# EAGLE design LiFiShieldV2 (EAGLE 9.2.2)
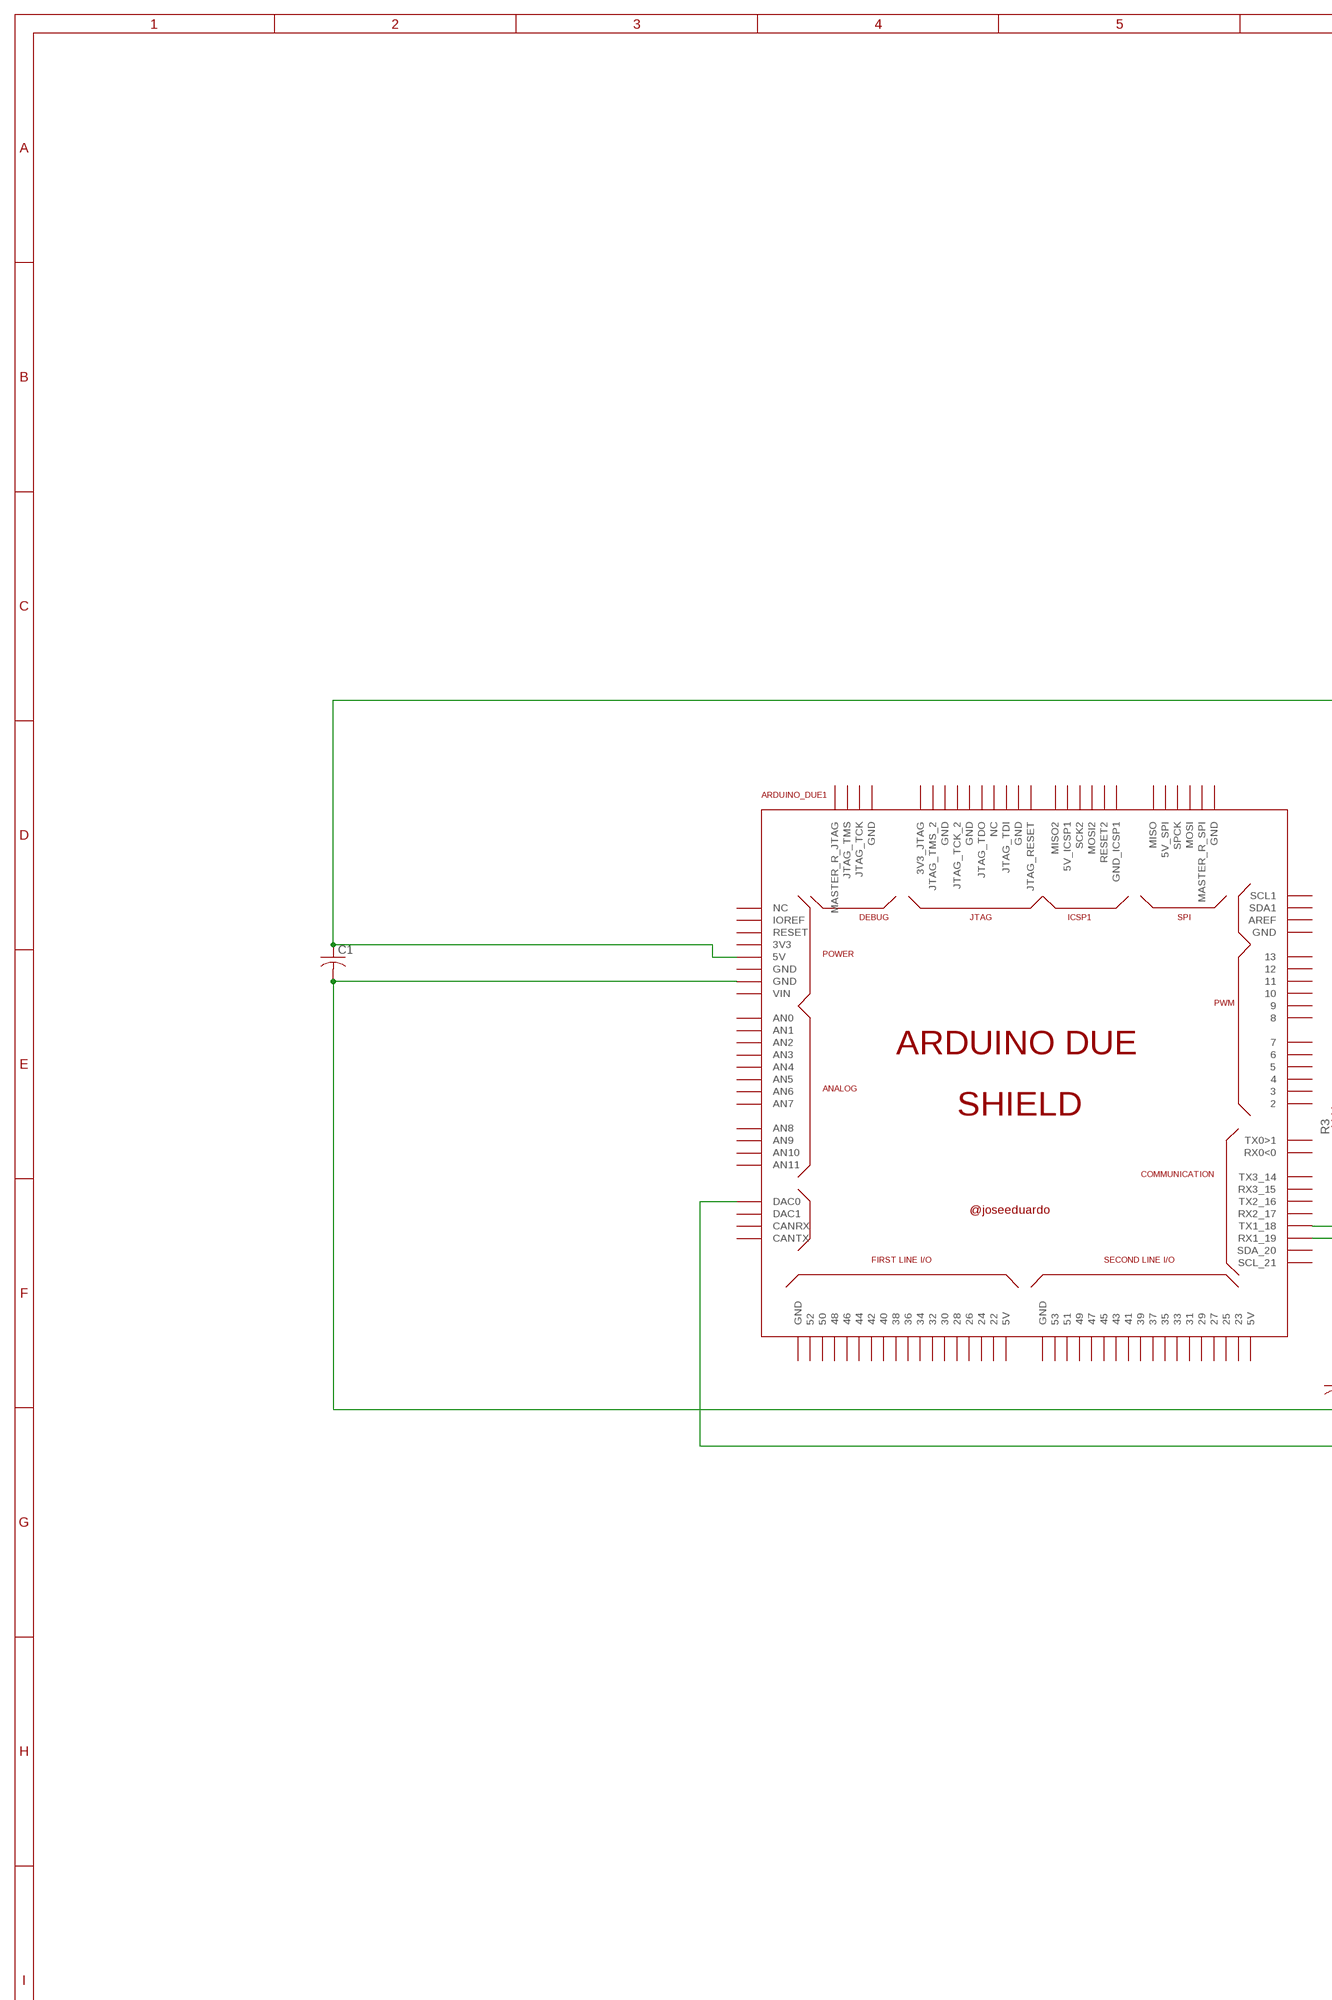
[diagram p0: schematic, sheet 1, part 1 of 2]
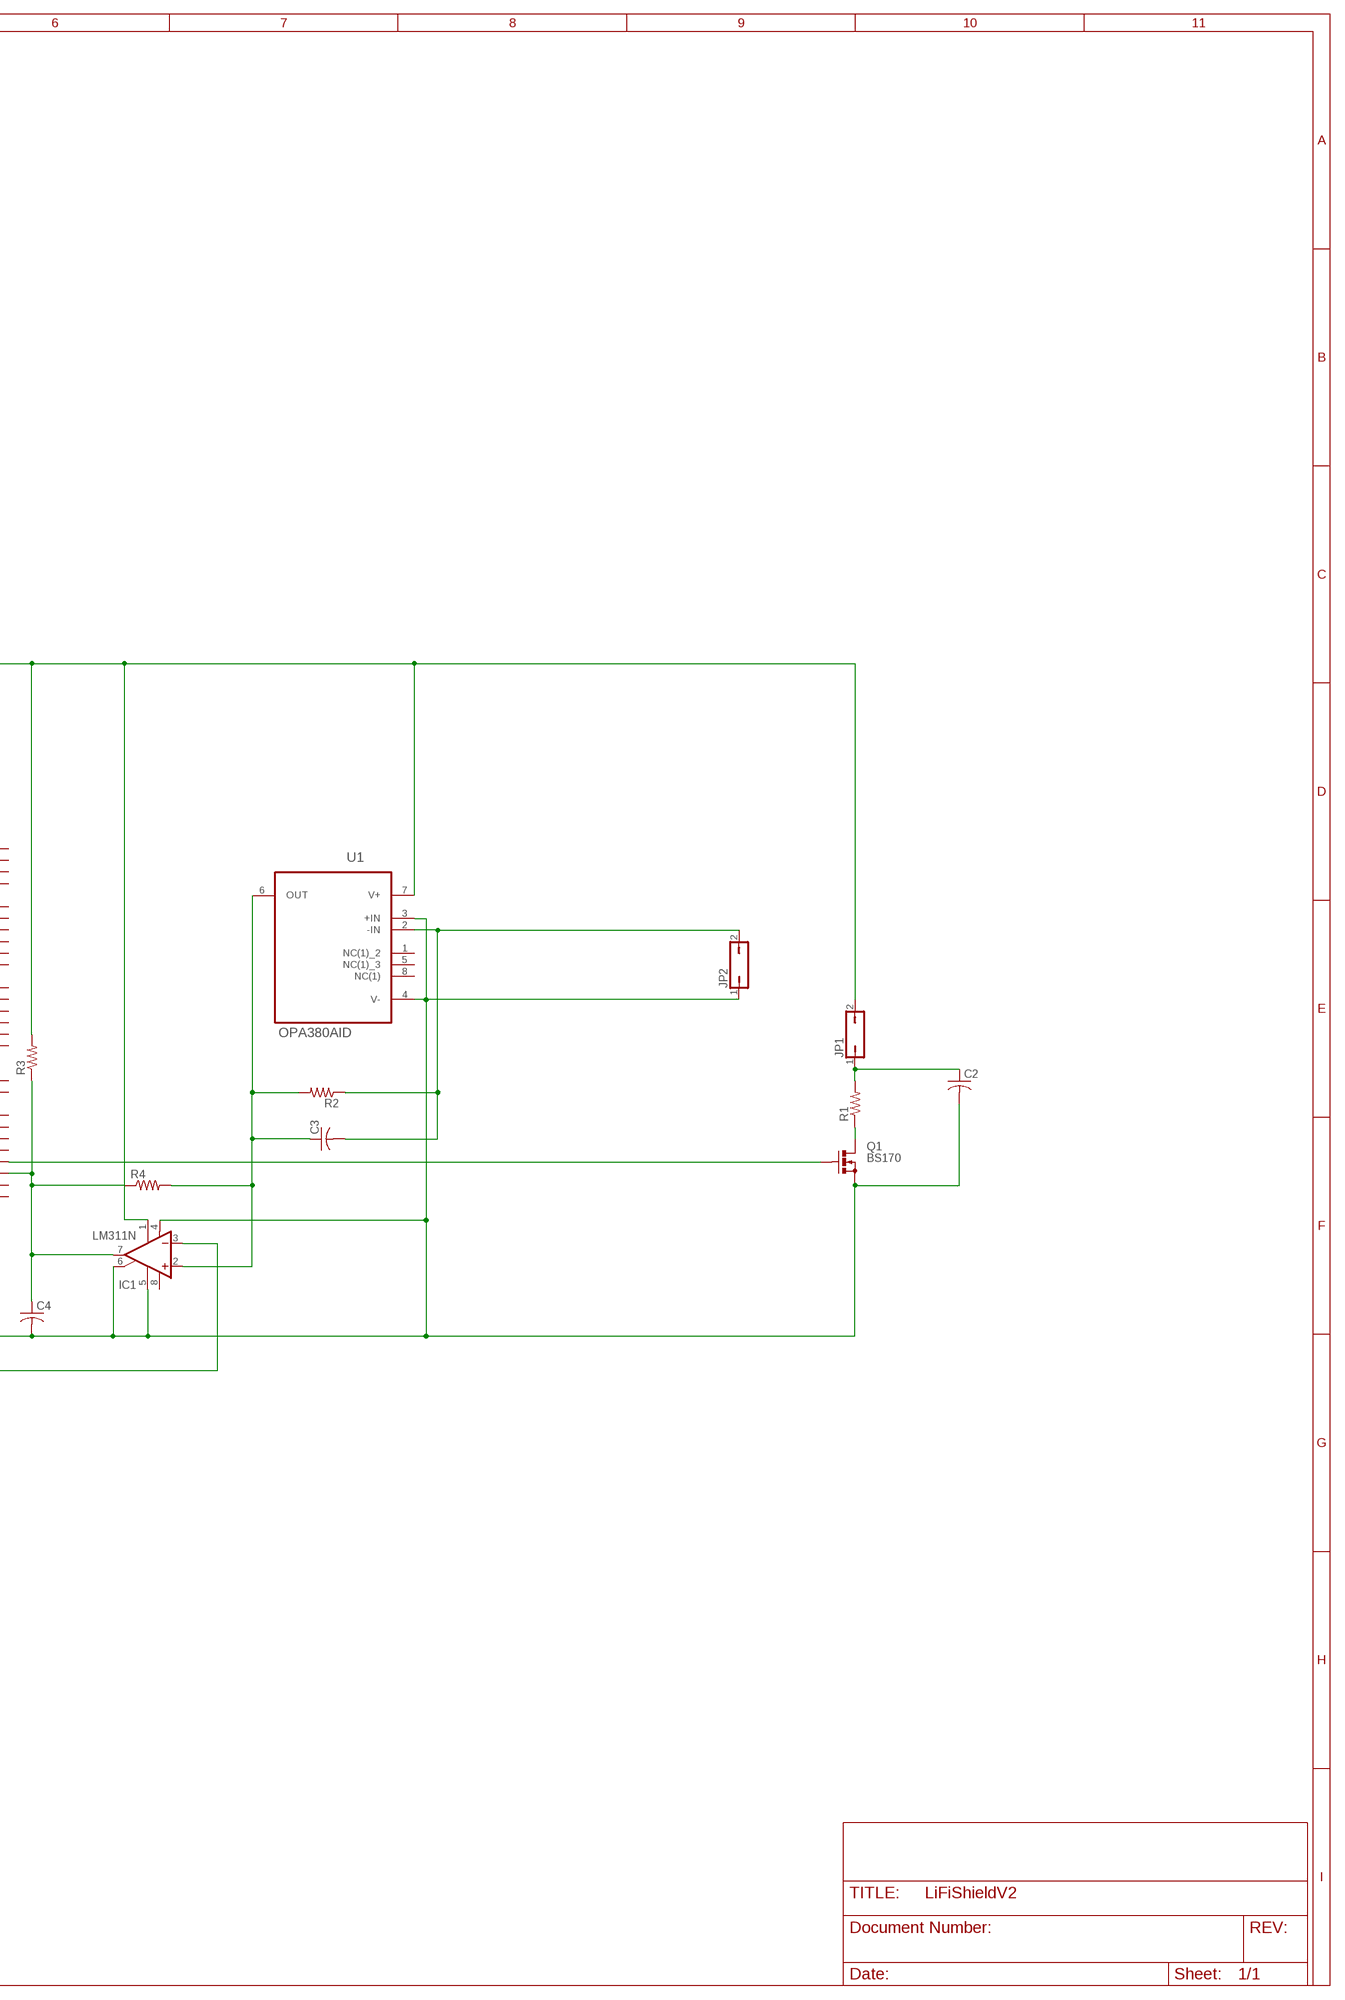
[diagram p1: schematic, sheet 1, part 2 of 2]

## Parts
ARDUINO_DUE1  ARDUINO_DUE_SHIELD  [ARDUINO_DUE_SHIELD]
C1  C-US050-055X075  [C050-055X075]
C2  C-US050-055X075  [C050-055X075]
C3  C-US050-055X075  [C050-055X075]
C4  C-US050-055X075  [C050-055X075]
IC1  LM311N  [DIL08]
JP1  JP1Q  [JP1]
JP2  JP1Q  [JP1]
Q1  BS170  [SOT54E]
R1  R-US_0204/7  [0204/7]
R2  R-US_0204/7  [0204/7]
R3  R-US_0204/7  [0204/7]
R4  R-US_0204/7  [0204/7]
U1  OPA380AID  [SOIC127P600X175-8N]

## Nets
N$1: C2.1 JP1.1 R1.2
N$2: Q1.D R1.1
N$3: ARDUINO_DUE1.DAC0 IC1.3(-IN)
N$4: ARDUINO_DUE1.18(TX1_18) Q1.G
N$5: C3.1 IC1.2(+IN) R2.2 R4.2 U1.6(OUT)
N$6: C3.2 JP2.2 R2.1 U1.2(-IN)
N$7: ARDUINO_DUE1.19(RX1_19) C4.1 IC1.7(OUT) R3.1 R4.1
N$8: ARDUINO_DUE1.GND_1(GND) C1.2 C2.2 C4.2 IC1.4(V-) IC1.5(ON) IC1.6(ON/STR) JP2.1 Q1.S U1.3(+IN) U1.4(V-)
N$9: ARDUINO_DUE1.5V0(5V) C1.1 IC1.1(GND) JP1.2 R3.2 U1.7(V+)
Unconnected: ARDUINO_DUE1.0(RX0<0) ARDUINO_DUE1.1(TX0>1) ARDUINO_DUE1.2 ARDUINO_DUE1.3 ARDUINO_DUE1.3V3 ARDUINO_DUE1.3V3_JTAG ARDUINO_DUE1.4 ARDUINO_DUE1.5 ARDUINO_DUE1.5V0_1(5V) ARDUINO_DUE1.5V0_2(5V) ARDUINO_DUE1.5V_2(5V_SPI) ARDUINO_DUE1.5V_ICSP1 ARDUINO_DUE1.6 ARDUINO_DUE1.7 ARDUINO_DUE1.8 ARDUINO_DUE1.9 ARDUINO_DUE1.10 ARDUINO_DUE1.11 ARDUINO_DUE1.12 ARDUINO_DUE1.13 ARDUINO_DUE1.14(TX3_14) ARDUINO_DUE1.15(RX3_15) ARDUINO_DUE1.16(TX2_16) ARDUINO_DUE1.17(RX2_17) ARDUINO_DUE1.20(SDA_20) ARDUINO_DUE1.21(SCL_21) ARDUINO_DUE1.22 ARDUINO_DUE1.23 ARDUINO_DUE1.24 ARDUINO_DUE1.25 ARDUINO_DUE1.26 ARDUINO_DUE1.27 ARDUINO_DUE1.28 ARDUINO_DUE1.29 ARDUINO_DUE1.30 ARDUINO_DUE1.31 ARDUINO_DUE1.32 ARDUINO_DUE1.33 ARDUINO_DUE1.34 ARDUINO_DUE1.35 ARDUINO_DUE1.36 ARDUINO_DUE1.37 ARDUINO_DUE1.38 ARDUINO_DUE1.39 ARDUINO_DUE1.40 ARDUINO_DUE1.41 ARDUINO_DUE1.42 ARDUINO_DUE1.43 ARDUINO_DUE1.44 ARDUINO_DUE1.45 ARDUINO_DUE1.46 ARDUINO_DUE1.47 ARDUINO_DUE1.48 ARDUINO_DUE1.49 ARDUINO_DUE1.50 ARDUINO_DUE1.51 ARDUINO_DUE1.52 ARDUINO_DUE1.53 ARDUINO_DUE1.A0(AN0) ARDUINO_DUE1.A1(AN1) ARDUINO_DUE1.A2(AN2) ARDUINO_DUE1.A3(AN3) ARDUINO_DUE1.A4(AN4) ARDUINO_DUE1.A5(AN5) ARDUINO_DUE1.A6(AN6) ARDUINO_DUE1.A7(AN7) ARDUINO_DUE1.A8(AN8) ARDUINO_DUE1.A9(AN9) ARDUINO_DUE1.A10(AN10) ARDUINO_DUE1.A11(AN11) ARDUINO_DUE1.AREF ARDUINO_DUE1.CANRX ARDUINO_DUE1.CANTX ARDUINO_DUE1.DAC1 ARDUINO_DUE1.GND ARDUINO_DUE1.GND_2(GND) ARDUINO_DUE1.GND_3(GND) ARDUINO_DUE1.GND_4(GND) ARDUINO_DUE1.GND_5(GND) ARDUINO_DUE1.GND_7(GND) ARDUINO_DUE1.GND_8(GND) ARDUINO_DUE1.GND_9(GND) ARDUINO_DUE1.GND_10(GND) ARDUINO_DUE1.GND_ICSP1 ARDUINO_DUE1.IOREF ARDUINO_DUE1.JTAG_RESET ARDUINO_DUE1.JTAG_TCK ARDUINO_DUE1.JTAG_TCK_2 ARDUINO_DUE1.JTAG_TDI ARDUINO_DUE1.JTAG_TDO ARDUINO_DUE1.JTAG_TMS ARDUINO_DUE1.JTAG_TMS_2 ARDUINO_DUE1.MASTER_RESET_JTAG(MASTER_R_JTAG) ARDUINO_DUE1.MASTER_RESET_SPI(MASTER_R_SPI) ARDUINO_DUE1.MISO ARDUINO_DUE1.MISO2 ARDUINO_DUE1.MOSI ARDUINO_DUE1.MOSI2 ARDUINO_DUE1.NC_2(NC) ARDUINO_DUE1.NC_5(NC) ARDUINO_DUE1.RESET ARDUINO_DUE1.RESET2 ARDUINO_DUE1.SCK2 ARDUINO_DUE1.SCL1 ARDUINO_DUE1.SDA1 ARDUINO_DUE1.SPCK ARDUINO_DUE1.VIN U1.1(NC(1)_2) U1.5(NC(1)_3) U1.8(NC(1))

## Power pins joined to a net without a drawn wire
V+: IC1.8(V+)

## Library data of the parts
ARDUINO_DUE1 = arduino_due_shield:ARDUINO_DUE_SHIELD
C1-C4 = adafruit:C-US: CAPACITOR, American symbol
IC1 = linear:LM311: COMPARATOR
JP1 JP2 = jumper:JP1Q: JUMPER
Q1 = transistor-small-signal:BS170: N-CHANNEL MOS FET
R1-R4 = adafruit:R-US_: RESISTOR, American symbol
U1 = Texas Instruments_By_element14_Batch_1:OPA380AID: Precision, High-Speed Transimpedance Amplifier; MPN: OPA380AID; OC_FARNELL: -; OC_NEWARK: 01J0608; PACKAGE: SOIC-8; SUPPLIER: Texas Instruments

## Net classes
0 default: width 0.508 mm

## Board
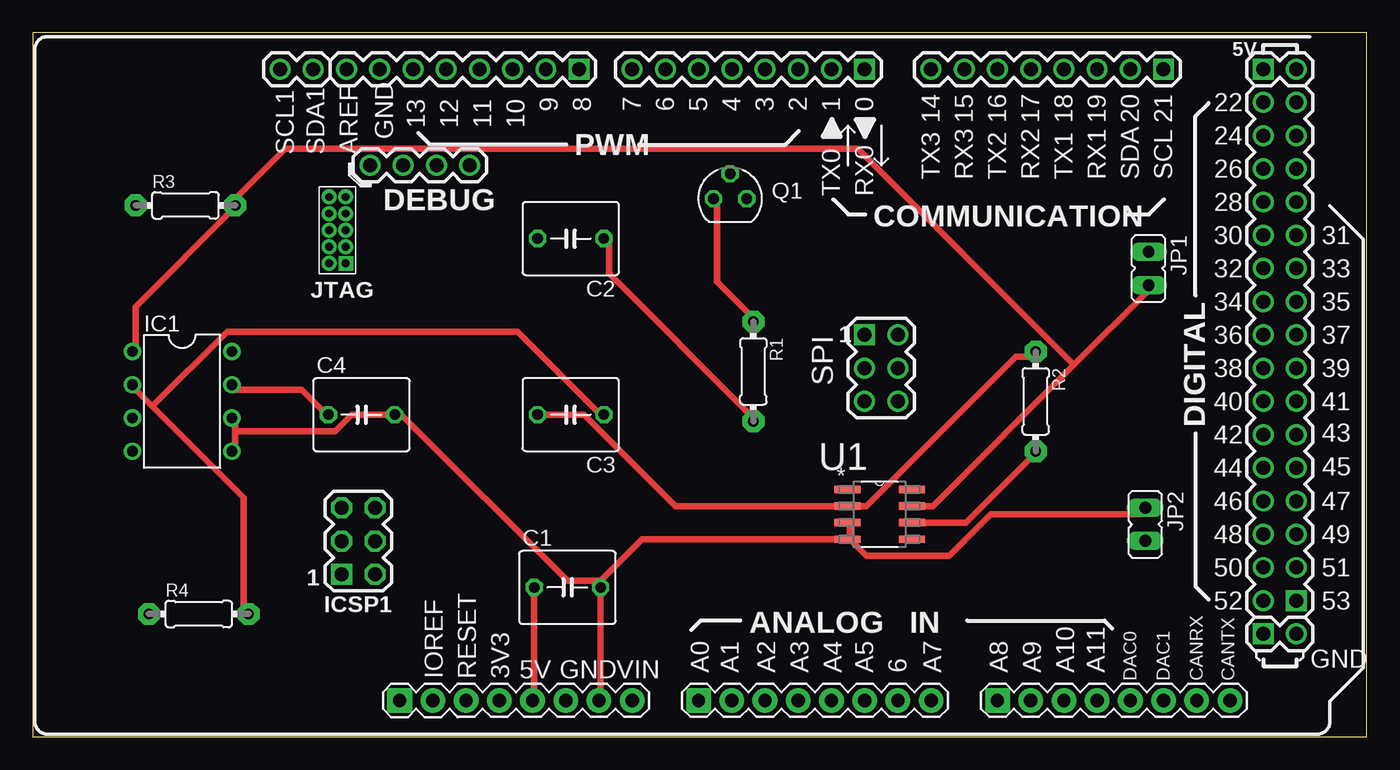
[diagram p2: board, top side]
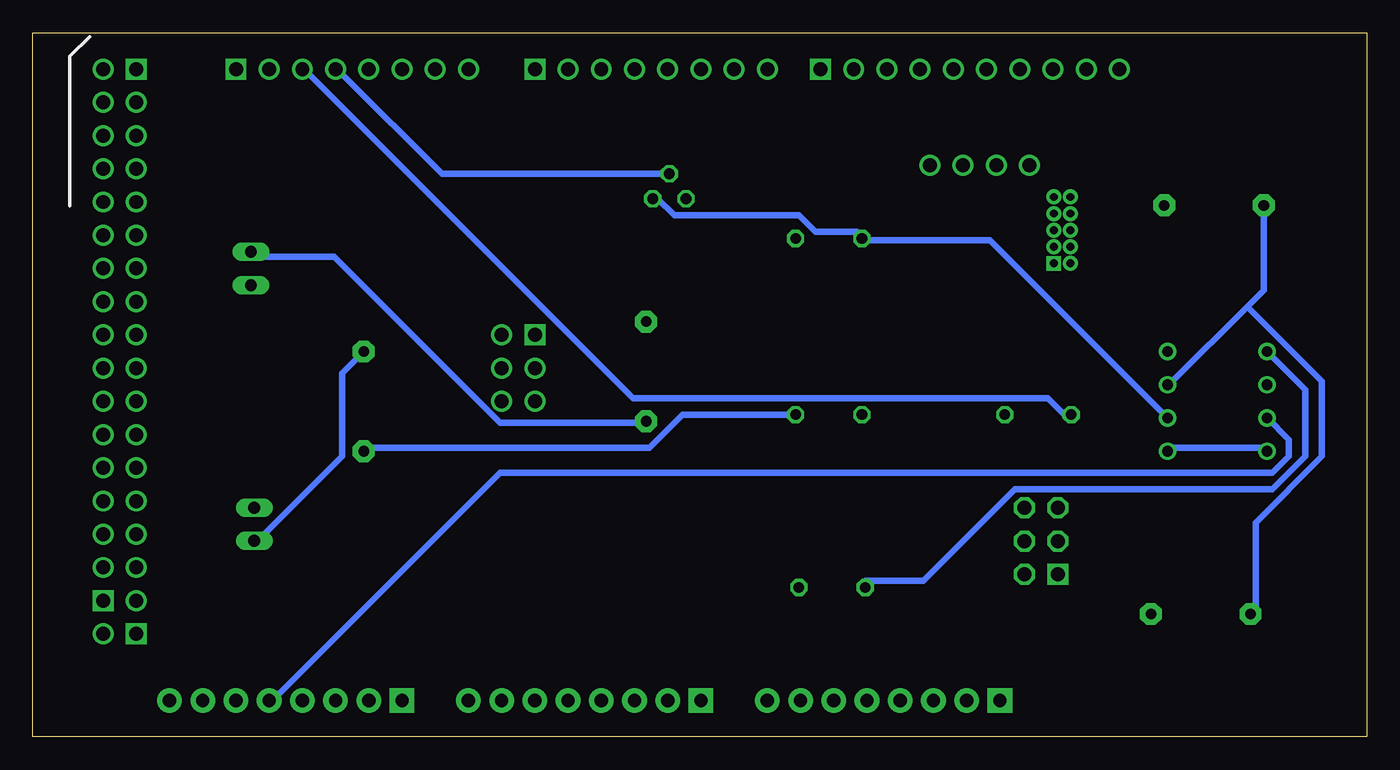
[diagram p3: board, bottom side, seen from below]

Size 102.03 x 53.84 mm. Coordinates in mm from the lower left corner, seen from the top.
Outline: 0,0 102.03,0 102.03,53.84 0,53.84 0,0
Copper layers (1*16): Top 0.035mm / dielectric 1.5mm / Bottom 0.035mm
Design rules "default": minimum track width 6mil, minimum drill 0.35mm, track to track 6mil, track to pad 6mil, pad to pad 6mil, via to via 6mil, smd to smd 6mil, copper to edge 40mil, drill to drill 6mil, minimum pad ring 10mil, minimum via ring 8mil, stop-mask expansion 4mil, vias tented up to drill 0mil, thermal gap 10mil

### Footprints (pad centres in the part's own frame; a part is rotated, then mirrored left to right if it is on the bottom)
ARDUINO_DUE_SHIELD = drill 1.067 square: 0 63.373,51.816; 5V0_1 93.853,51.816; 8 41.529,51.816; 21 86.233,51.816; 53 96.393,11.176; GND_2 93.853,8.636; MISO 63.373,31.496; MISO2 23.384,13.196 | drill 1.067: 1 60.833,51.816; 2 58.293,51.816; 3 55.753,51.816; 4 53.213,51.816; 5 50.673,51.816; 5V0_2 96.393,51.816; 5V_2 65.913,31.496; 6 48.133,51.816; 7 45.593,51.816; 9 38.989,51.816; 10 36.449,51.816; 11 33.909,51.816; 12 31.369,51.816; 13 28.829,51.816; 14 68.453,51.816; 15 70.993,51.816; 16 73.533,51.816; 17 76.073,51.816; 18 78.613,51.816; 19 81.153,51.816; 20 83.693,51.816; 22 93.853,49.276; 23 96.393,49.276; 24 93.853,46.736; 25 96.393,46.736; 26 93.853,44.196; 27 96.393,44.196; 28 93.853,41.656; 29 96.393,41.656; 30 93.853,39.116; 31 96.393,39.116; 32 93.853,36.576; 33 96.393,36.576; 34 93.853,34.036; 35 96.393,34.036; 36 93.853,31.496; 37 96.393,31.496; 38 93.853,28.956; 39 96.393,28.956; 40 93.853,26.416; 41 96.393,26.416; 42 93.853,23.876; 43 96.393,23.876; 44 93.853,21.336; 45 96.393,21.336; 46 93.853,18.796; 47 96.393,18.796; 48 93.853,16.256; 49 96.393,16.256; 50 93.853,13.716; 51 96.393,13.716; 52 93.853,11.176; AREF 23.749,51.816; GND_3 96.393,8.636; GND_4 26.289,51.816; GND_5 65.913,26.416; GND_7 33.161,44.473; JTAG_TCK 30.621,44.473; JTAG_TMS 28.081,44.473; MASTER_RESET_JTAG 25.541,44.473; MASTER_RESET_SPI 63.373,26.416; MOSI 65.913,28.956; SCL1 18.669,51.816; SDA1 21.209,51.816; SPCK 63.373,28.956 | drill 1.016 pad 1.88: 3V3 35.433,3.556; 5V0 37.973,3.556; A1 53.213,3.556; A2 55.753,3.556; A3 58.293,3.556; A4 60.833,3.556; A5 63.373,3.556; A6 65.913,3.556; A7 68.453,3.556; A9 76.073,3.556; A10 78.613,3.556; A11 81.153,3.556; CANRX 88.773,3.556; CANTX 91.313,3.556; DAC0 83.693,3.556; DAC1 86.233,3.556; GND 40.513,3.556; GND_1 43.053,3.556; IOREF 30.346,3.543; RESET 32.893,3.555; VIN 45.593,3.556 | drill 0.6 pad 1.016 square: 3V3_JTAG 23.689,36.964 | drill 1.067 octagon: 5V_ICSP1 25.924,13.196; GND_ICSP1 25.924,18.276; MOSI2 25.924,15.736; RESET2 23.384,18.276; SCK2 23.384,15.736 | drill 1.016 pad 1.88 square: A0 50.673,3.556; A8 73.533,3.556; NC_2 27.806,3.543 | drill 0.6 pad 1.143: GND_8 23.689,38.234; GND_9 23.689,40.774; GND_10 23.689,42.044; JTAG_RESET 22.419,42.044; JTAG_TCK_2 22.419,38.234; JTAG_TDI 22.419,40.774; JTAG_TDO 22.419,39.504; JTAG_TMS_2 22.419,36.964; NC_5 23.689,39.504
C050-055X075 = drill 0.813 octagon: 1 -2.54,0; 2 2.54,0
DIL08 = drill 0.813 pad 1.27: 1 -3.81,-3.81; 2 -1.27,-3.81; 3 1.27,-3.81; 4 3.81,-3.81; 5 3.81,3.81; 6 1.27,3.81; 7 -1.27,3.81; 8 -3.81,3.81
JP1 = drill 0.914 long: 1 0,-1.27; 2 0,1.27
SOT54E = drill 0.813 octagon: D -1.27,0; G 0,1.905; S 1.27,0
0204/7 = drill 0.813 pad 1.676 octagon: 1 -3.81,0; 2 3.81,0
SOIC127P600X175-8N = smd 1.981 x 0.559: 1 -2.464,1.905; 2 -2.464,0.635; 3 -2.464,-0.635; 4 -2.464,-1.905; 5 2.464,-1.905; 6 2.464,-0.635; 7 2.464,0.635; 8 2.464,1.905

### Placement (x,y rotation side)
ARDUINO_DUE1  0.25,-0.76 0 top
C1  40.89,11.43 0 top
C2  41.15,38.1 180 top
C3  41.15,24.64 180 top
C4  25.15,24.64 0 top
IC1  11.43,25.65 270 top
JP1  85.34,35.81 180 top
JP2  85.09,16.26 180 top
Q1  53.34,41.15 0 top
R1  55.12,27.94 270 top
R2  76.71,25.65 270 top
R3  11.68,40.64 0 top
R4  12.7,9.4 0 top
U1  64.77,17.02 0 top

### Tracks (layer width: path | path; a pad name or v marks a point on that pad's centre or on a via)
N$1
  Top 0.508: C2.1 44.07,37.97 44.07,35.43 54.86,24.64 R1.2
  Bottom 0.508: JP1.1 85.34,36.7 78.99,36.7 66.29,24 55.5,24 R1.2
N$2
  Top 0.508: Q1.D 52.32,41.15 52.32,34.8 54.86,32.26 R1.1
N$3
  Bottom 0.508: IC1.3 5.97,22.73 5.97,21.46 7.24,20.19 66.29,20.19 83.44,3.05 ARDUINO_DUE1.DAC0
N$4
  Bottom 0.508: Q1.G 70.74,43.05 78.36,50.67 ARDUINO_DUE1.18
N$5
  Top 0.508: 9.14,25.27 16.13,18.29 16.13,9.4 R4.2 | 9.14,25.27 7.87,26.54 IC1.2 | U1.6 71.37,16.38 76.45,21.46 R2.2 | 9.14,25.27 14.86,30.99 37.08,30.99 43.43,24.64 C3.1
  Bottom 0.508: C3.1 52.32,24.64 54.86,22.1 76.45,22.1 R2.2
N$6
  Top 0.508: R2.1 76.45,29.08 75.18,29.08 63.75,17.65 U1.2 49.15,17.65 42.16,24.64 C3.2
  Bottom 0.508: R2.1 78.36,27.81 78.36,21.46 84.71,15.11 JP2.2
N$7
  Top 0.508: IC1.7 15.49,26.54 20.57,26.54 22.48,24.64 C4.1
  Bottom 0.508: ARDUINO_DUE1.19 80.9,50.67 56.13,25.91 24.38,25.91 23.11,24.64 C4.1 | R3.1 7.87,34.16 9.14,32.89 | 9.14,32.89 14.86,27.18 IC1.7 | 9.14,32.89 3.43,27.18 3.43,21.46 8.51,16.38 8.51,9.4 R4.1
N$8
  Top 0.508: 62.48,15.11 62.48,16.38 U1.3 | 43.43,11.94 46.61,15.11 U1.4 62.48,15.11 | 62.48,15.11 63.75,13.84 70.1,13.84 73.28,17.02 84.71,17.02 JP2.1 | ARDUINO_DUE1.GND_1 43.43,3.05 C1.2 43.43,11.94 | 15.49,23.37 15.49,22.1 IC1.5 | 15.49,23.37 15.49,24 IC1.6 | 15.49,23.37 23.11,23.37 24.38,24.64 C4.2 28.19,24.64 40.89,11.94 43.43,11.94
  Bottom 0.508: Q1.S 54.23,41.15 52.96,39.88 43.43,39.88 42.16,38.61 38.99,38.61 C2.2 38.35,37.97 28.83,37.97 IC1.6 | IC1.4 7.87,22.1 14.86,22.1 IC1.5
N$9
  Top 0.508: U1.7 68.83,17.65 79.63,28.45 | 79.63,28.45 85.34,34.16 JP1.2 | C1.1 38.35,3.05 ARDUINO_DUE1.5V0 | IC1.1 7.87,29.72 7.87,32.89 15.49,40.51 R3.2 15.49,41.15 19.3,44.96 63.12,44.96 79.63,28.45
  Bottom 0.508: IC1.1 4.7,26.54 4.7,21.46 7.24,18.92 26.92,18.92 33.91,11.94 38.35,11.94 C1.1